# Altium project SDR_cubesat.PrjPcb (part 1 of 2)
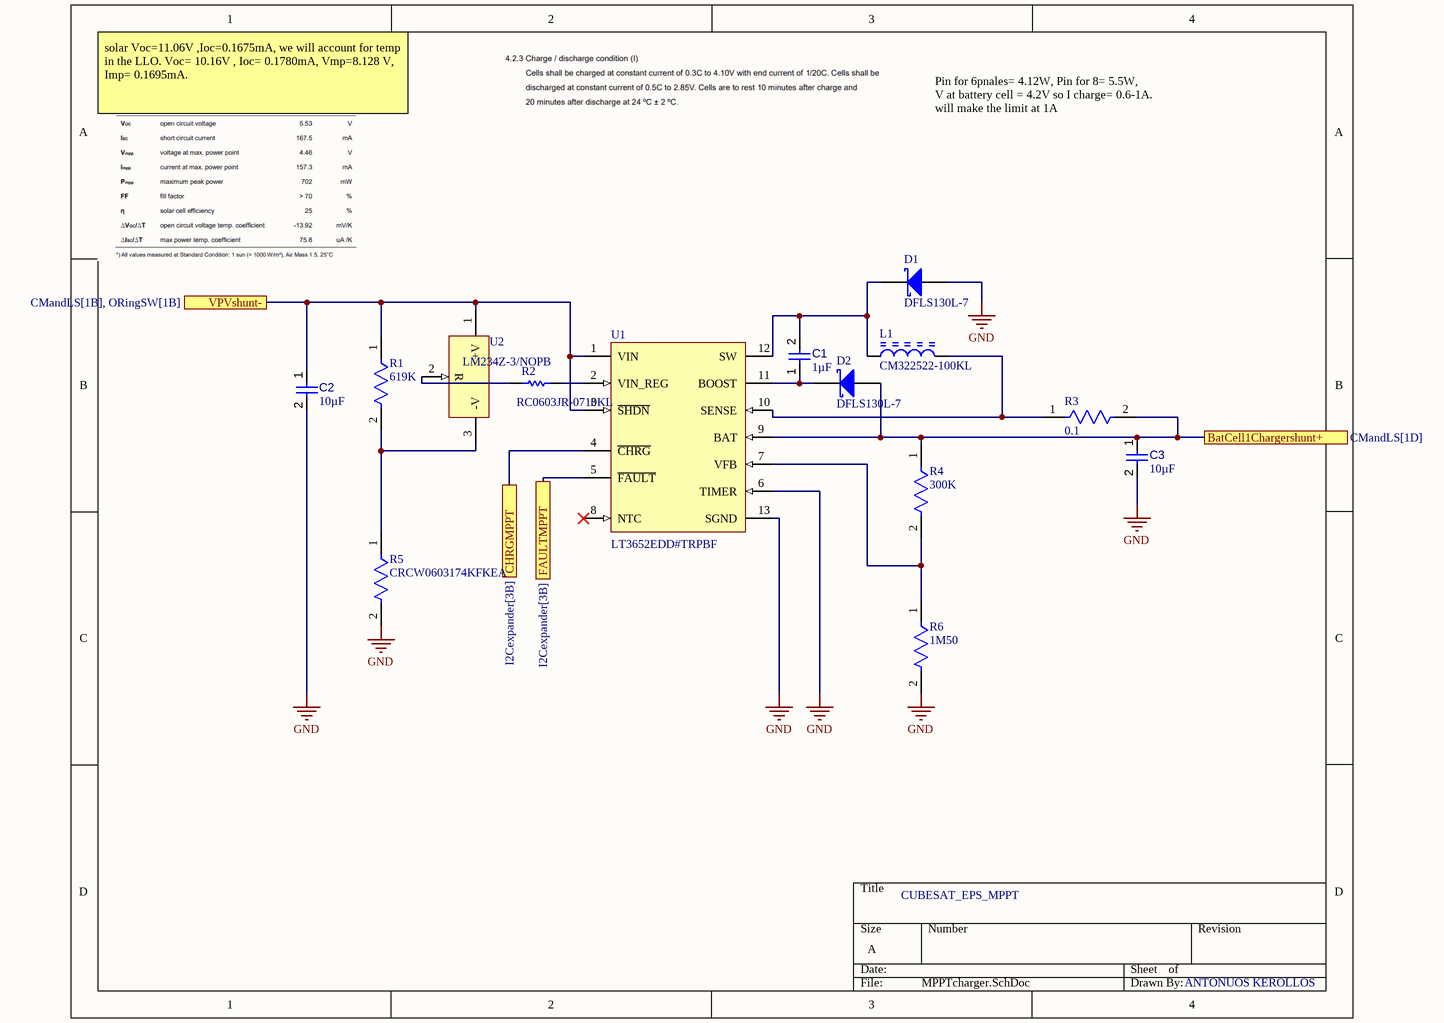
[diagram p0: MPPTcharger.SchDoc]
Drawn by: Antonuos Kerollos
10 sheets, 143 parts. Net scope: flat (ports and power ports of the same name join across sheets).
Board file: EPS.PcbDoc
Sheets:
  MPPTcharger.SchDoc
  REG3V3.SchDoc
  REG5V.SchDoc
  ORingSW.SchDoc
  I2Cexpander.SchDoc
  battery.SchDoc
  CMandLS.SchDoc
  burnwire.SchDoc
  SolarConnectors.SchDoc
  connectors.SchDoc

## Sheet MPPTcharger.SchDoc
size A; SheetNumber: 1; SheetTotal: 10

### Parts
C1  value 1µF  [CAPC0402(1005)60_L]  (hidden comment: Capacitor 1µF +/-20% 10V 0402)
C2  value 10µF  [CAPC0402(1005)60_L]  (hidden comment: Capacitor 10µF +/-40% 6.3V 0402)
C3  value 10µF  [CAPC0402(1005)60_L]  (hidden comment: Capacitor 10µF +/-40% 6.3V 0402)
D1  DFLS130L-7  [DIOD-POWERDI123-2_A_V]
D2  DFLS130L-7  [DIOD-POWERDI123-2_A_V]
L1  CM322522-100KL  [BOUR-CM322522_V]
R1  619K  [FP-CRCW0805-e3-IPC_C]
R2  RC0603JR-0710KL  [RESC1608X55X25ML10T15]
R3  0.1  [FP-ERJ8BW-IPC_A]
R4  300K  [FP-CRCW0402-e3-IPC_C]
R5  CRCW0603174KFKEA  [FP-CRCW0603-e3-IPC_B]
R6  1M50  [FP-CRCW0402-e3-IPC_C]
U1  LT3652EDD#TRPBF  [LT-DD-12_V]
U2  LM234Z-3/NOPB  [LP0003A]

### Ports
BatCell1Chargershunt+ (see CMandLS[1D]), CHRGMPPT (see I2Cexpander[3B]), FAULTMPPT (see I2Cexpander[3B]), VPVshunt- (see CMandLS[1B], ORingSW[1B])

### Nets
GND: C2.2 C3.2 D1.1(A) R5.2 R6.2 U1.6(TIMER) U1.13(SGND)
PV power: C2.1 R1.1 U1.1(VIN) U1.3(~{SHDN}) U2.1(+V) ; port VPVshunt-
NetC1_1: C1.1 D2.2(K) U1.11(BOOST)
NetC1_2: C1.2 D1.2(K) L1.1 U1.12(SW)
NetC3_1: C3.1 D2.1(A) R3.2 R4.1 U1.9(BAT) ; port BatCell1Chargershunt+
NetIC2_1: U1.4(~{CHRG}) ; port CHRGMPPT
NetIC2_2: U1.5(~{FAULT}) ; port FAULTMPPT
NetL1_2: L1.2 R3.1 U1.10(SENSE)
NetR1_2: R1.2 R5.1 U2.3(-V)
NetR2_1: R2.1 U1.2(VIN_REG)
NetR2_2: R2.2 U2.2(R)
NetR4_2: R4.2 R6.1 U1.7(VFB)

Not connected (* = marked no-connect by the designer): U1 8(NTC)*

### Notes on the sheet
- solar Voc=11.06V ,Ioc=0.1675mA, we will account for temp in the LLO. Voc= 10.16V , Ioc= 0.1780mA, Vmp=8.128 V, Imp= 0.1695mA.
- Pin for 6pnales= 4.12W, Pin for 8= 5.5W,                 V at battery cell = 4.2V so I charge= 0.6-1A.                      will make the limit at 1A
- CUBESAT_EPS_MPPT
- ANTONUOS KEROLLOS

### Library data of the parts
C1 = CMP-001-00063-3: Chip Capacitor, 1µF +/-20%, 10V, 0402, Thickness 0.6 mm; Tolerance: 10%; Mounting Technology: SMT; Max Operating Temperature: 85°C; Voltage Rating: 10V; Pins: 2; Case/Package: 0402; Min Operating Temperature: -55°C
C2 C3 = CMP-001-00074-3: Chip Capacitor, 10µF +/-40%, 6.3V, 0402, Thickness 0.6 mm; Tolerance: 10%; Case/Package: 0402; Pins: 2; Mounting Technology: SMT; Voltage Rating: 6.3V; Max Operating Temperature: 85°C; Min Operating Temperature: -55°C
D1 D2 = CMP-2000-07448-1: Schottky Barrier Rectifier, 30 V, 1 A, -40 to 125 degC, 2-Pin SMD, RoHS, Tape and Reel; Manufacturer: Diodes Inc; Max Repetitive Reverse Voltage (Vrrm): 30V; Polarity: Standard; Average Rectified Current: 1A; Element Configuration: Single; Forward Voltage: 360mV; Peak Non-Repetitive Surge Current: 50A; Max Power Dissipation: 1.67W; Case\/Package: SMD/SMT; Capacitance: 76pF; Peak Reverse Current: 1mA; Datasheet URL: https://www.diodes.com/assets/Datasheets/ds30492.pdf; Package Quantity: 3000; Reverse Voltage (DC): 30V; Package Reference: POWERDI123-2_A; Lead Free: LeadFree; Mounting Technology: SurfaceMount; Max Operating Temperature: 125degC; Current Rating: 1A; Radiation Hardening: No; Width: 1.78mm; Height: 0.98mm; Output Current: 1A; Contact Plating: Matte; Length: 2.8mm; Number of Pins: 2; Voltage Rating (DC): 30V; RoHSCompliant: true; Termination: SMD/SMT; Forward Current: 1A; Min Operating Temperature: -40degC; Datasheet Version: Rev. 4-2, 06/2009; Packaging: TapeandReel; REACH SVHC: NoSVHC; Max Forward Surge Current (Ifsm): 50A; Manufacturer URL: http://www.diodes.com/; Mount: SurfaceMount; Package Description: 2-Pin Small Outline Diode, Body 2.8 x 1.78 mm
L1 = CMP-1747-00008-1: Chip Inductor / , 10 uH, +/- 10%, -40 to 125 degC, 1210 (3225 Metric), RoHS, Tape and Reel; Current Rating: 1.5 A; Colour: White; Gender: Female; Connector Type: USB; Min Operating Temperature: -55 degC; ComponentLink2Description: Datasheet; Packaging: Tray; Contact Material: Bronze; ComponentLink1Description: Manufacturer URL; PackageDescription: 2-Pin Surface Mount Device, Body 3.2 x 2.5 mm; Contact Plating: Gold; Max Operating Temperature: 85 degC; ComponentLink2URL: http://www.bourns.com/docs/Product-Datasheets/cm322522.pdf; PackageReference: 1210; Radiation Hardening: No; DatasheetVersion: Aug-14; Package Quantity: 100; Pins: 4; Mount: Through Hole; Lead Pitch: 2.5 mm; ComponentLink1URL: http://www.bourns.com/; Height: 15.9 mm; RoHSCompliant: true; Width: 11.15 mm
R1 = CMP-2001-04045-2: RES Thick Film, 619kΩ, 1%, 0.125W, 100ppm/°C, 0805; Voltage Rating: 150V; Power Rating: 125mW; Resistance: 619kR; Width: 0.049inch; Lead Free: Lead Free; Case/Package: 0805; Termination: SMD/SMT; Height: 0.02inch; Composition: Thick Film; Depth: 1.25mm; Max Operating Temperature: 155°C; Voltage Rating (DC): 150V; Temperature Coefficient: 100ppm/°C; Military Standard: Not; Working Voltage: 150V; Radiation Hardening: No; Weight: 0.000194oz; Min Operating Temperature: -55°C; Features: Automotive AEC-Q200; Case Code (Metric): 2012; Case Code (Imperial): 0805; Number of Terminations: 2; Tolerance: 1%; Contact Plating: Tin; Max Power Dissipation: 125mW; Length: 2mm; Packaging: Tape and Reel; Number of Pins: 2; Package Quantity: 10
R2 = CMP-2000-05022-1: Resistor, 10 KOhm, +/- 5%, 100 mW, -55 to 155 degC, 0603 (1608 Metric), RoHS, Tape and Reel; Manufacturer: Yageo; Resistance: 10kOhms; Voltage Rating: 50V; Temperature Coefficient: 100PPM/C; Power Rating: 100mW; Package Reference: 603; Series: RC; Case Code - mm: 1608; Packaging: Reel; Datasheet URL: http://www.farnell.com/datasheets/443971.pdf; Datasheet Version: Rev. 4, 04/2009; Operating Temperature Range: -55Cto+155C; Product: ThickFilmResistorsGeneralPurpose; Package Description: 2-Pin Surface Mount Device, Body 1.6 x 0.8 mm; Manufacturer URL: http://www.yageo.com/; Case Code - in: 0603; Tolerance: 5%; Termination Style: SMD/SMT
R3 = CMP-2003-00785-2: RES 0.1 OHM 1% 1W 1206; Resistance: 100mR; Temperature Coefficient: 100ppm/°C; Lead Free: Lead Free; Features: Automotive AEC-Q200; Case/Package: 1206; Width: 0.063inch; Radiation Hardening: No; Power Rating: 1W; Resistance Tolerance: 1%; Resistor Type: Thick Film; Max Power Dissipation: 1W; Case Code (Metric): 3216; Package Quantity: 1; Tolerance: 1%; Number of Terminations: 2; Number of Pins: 2; Length: 3.2mm; Case Code (Imperial): 1206; Size Code: 1206; Mount: Surface Mount; Height: 0.65mm; Termination: SMD/SMT; Min Operating Temperature: -55°C; Packaging: Tape and Reel; Military Standard: Not; Series: ERJ; Depth: 1.6mm; REACH SVHC: No SVHC; Max Operating Temperature: 155°C; Contact Plating: Tin; Technology: THICK FILM; RoHS Compliant: Yes; Construction: Rectangular
R4 = CMP-2002-08495-2: RES Thick Film, 300kΩ, 1%, 0.063W, 100ppm/°C, 0402; Power Rating: 63mW; Resistance: 300kR; Voltage Rating: 50V; Case/Package: 0402; Number of Pins: 2; Depth: 0.5mm; Temperature Coefficient: 100ppm/°C; Composition: Thick Film; Length: 1mm; Termination: SMD/SMT; Tolerance: 1%; Features: Automotive AEC-Q200; Max Power Dissipation: 63mW; Packaging: Tape and Reel; Military Standard: Not; Case Code (Metric): 1005; Voltage Rating (DC): 50V; Lead Free: Lead Free; Max Operating Temperature: 155°C; Min Operating Temperature: -55°C; Width: 0.02inch; Package Quantity: 10; Height: 0.35mm; Case Code (Imperial): 0402; Number of Terminations: 2; Mount: Surface Mount; Radiation Hardening: No; Contact Plating: Tin; Weight: 2.3E-05oz
R5 = CMP-2000-02943-2: RES Thick Film, 174kΩ, 1%, 0.1W, 100ppm/°C, 0603; Power Rating: 100mW; Resistance: 174kR; Voltage Rating: 75V; Military Standard: Not; Max Operating Temperature: 155°C; Min Operating Temperature: -55°C; Radiation Hardening: No; Depth: 0.85mm; Composition: Thick Film; Width: 0.033inch; Max Power Dissipation: 100mW; Case Code (Imperial): 0603; Number of Pins: 2; Contact Plating: Tin; Number of Terminations: 2; Temperature Coefficient: 100ppm/°C; Features: Automotive AEC-Q200; Packaging: Tape and Reel; Length: 1.55mm; Weight: 7.1E-05oz; Termination: SMD/SMT; Case Code (Metric): 1608; Tolerance: 1%; Height: 0.02inch; Case/Package: 0603; Package Quantity: 10
R6 = CMP-2002-08330-2: RES Thick Film, 1.5MΩ, 1%, 0.063W, 100ppm/°C, 0402; Max Power Dissipation: 63mW; Voltage Rating: 50V; Resistance: 1.5MR; Military Standard: Not; Height: 0.35mm; Temperature Coefficient: 100ppm/°C; Max Operating Temperature: 155°C; Case Code (Metric): 1005; Case Code (Imperial): 0402; Number of Pins: 2; Radiation Hardening: No; Composition: Thick Film; Contact Plating: Tin; Case/Package: 0402; Features: Automotive AEC-Q200; Package Quantity: 10; Depth: 0.5mm; Weight: 2.3E-05oz; Mount: Surface Mount; Number of Terminations: 2; Min Operating Temperature: -55°C; Lead Free: Lead Free; Length: 1mm; Tolerance: 1%; Power Rating: 63mW; Voltage Rating (DC): 50V; Packaging: Tape and Reel; Termination: SMD/SMT; Width: 0.02inch
U1 = CMP-0473-00065-1: Power Tracking 2 A Battery Charger for Solar Power, 12-pin SON (DD-12), -40 to 125 degC, Pb-Free, Tape and Reel; Manufacturer: Linear Technology; Number of Outputs: 1; Vin Max(V): 32; Vin Min(V): 4.95; ComponentLink2URL: http://cds.linear.com/docs/en/datasheet/3652fd.pdf; ComponentLink3Description: Package Specification; Topology: Battery Charger; ComponentLink1URL: http://www.linear.com/; Energy Source: Solar; RoHS: TRUE; ComponentLink2Description: Datasheet; Packing: Tape and Reel; DatasheetVersion: Rev. D; PackageVersion: Rev. A, 06/2010; PartNumber: LT3652EDD#TRPBF; PackageReference: DD-12; Mounting Technology: Surface Mount; PackageDescription: 12-Pin Plastic DFN, Body 3 x 3 mm, Pitch 0.45 mm; ComponentLink3URL: http://cds.linear.com/docs/en/packaging/DFN_12_05-08-1725.pdf; ComponentLink1Description: Manufacturer URL
U2 = CMP-0063-00072-3: 3-Terminal Adjustable Current Source, 3-pin TO-92, Pb-Free; Manufacturer: Texas Instruments; PowerWise: N; CompType: MiscPower; PackageTopMarking: NSXYTT*LM234*Z-3; RoHS: Y; PinCount: 3; PackageDescription: TO-92, Molded, 3 Lead; Code_JEDEC: TO-226-AA; PackageReference: LP0003A; ComponentLink1URL: http://www.ti.com/general/docs/lit/getliterature.tsp?genericPartNumber=LM234&fileType=pdf; ComponentLink1Description: Datasheet URL

## Sheet REG3V3.SchDoc
size A; SheetNumber: 2; SheetTotal: 10
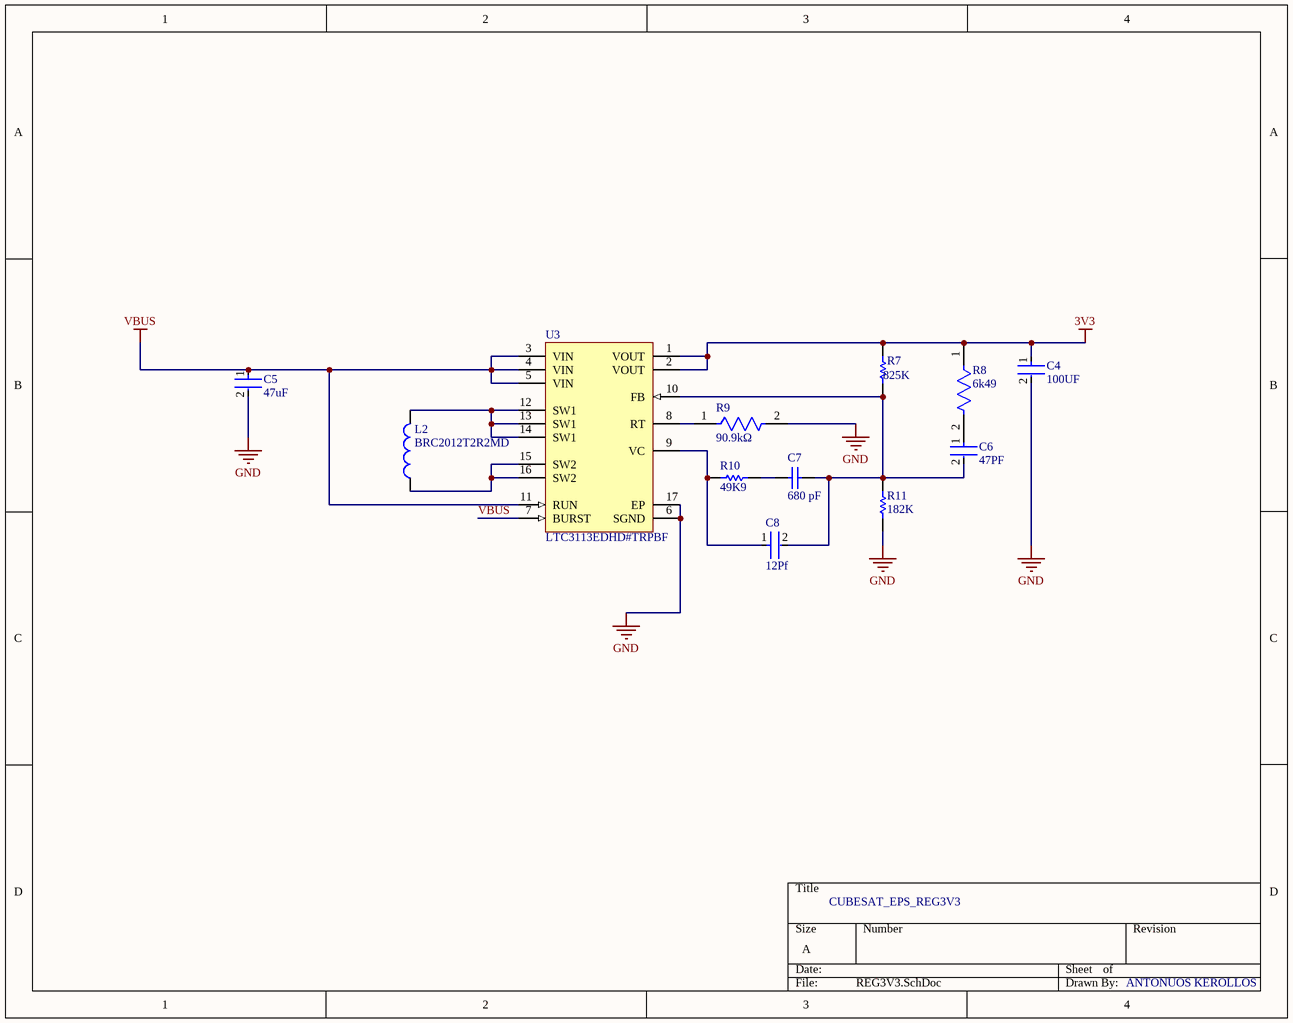
[diagram p1: REG3V3.SchDoc]

### Parts
C4  100UF  [FP-C1210C-FS-MFG]
C5  47uF  [FP-C3216-160-0_2-MFG]
C6  47PF  [FP-C0805C-DN-MFG]
C7  680 pF  [CAPC1005X55X25ML05T10]
C8  12Pf  [FP-C0603C-CF-MFG]
L2  BRC2012T2R2MD  [INDC2013X140X50LL20T20]
R7  825K  [RESC1005X40X25NL05T05]
R8  6k49  [FP-ERJ2RK-MFG]
R9  90.9kΩ  [FP-CRCW0402-e3-IPC_B]
R10  49K9  [RESC1005X40X25LL05T05]
R11  182K  [RESC1005X40X25ML05T05]
U3  LTC3113EDHD#TRPBF  [LT-DHD-16_V]

### Nets
3V3: C4.1 R7.2 R8.1 U3.1(VOUT) U3.2(VOUT)
GND: C4.2 C5.2 R9.2 R11.2 U3.6(SGND) U3.17(EP)
VBUS: C5.1 U3.3(VIN) U3.4(VIN) U3.5(VIN) U3.7(BURST) U3.11(RUN)
NetC6_1: C6.1 R8.2
NetC6_2: C6.2 C7.2 C8.2 R7.1 R11.1 U3.10(FB)
NetC7_1: C7.1 R10.2
NetC8_1: C8.1 R10.1 U3.9(VC)
NetL2_1: L2.1 U3.15(SW2) U3.16(SW2)
NetL2_2: L2.2 U3.12(SW1) U3.13(SW1) U3.14(SW1)
NetR9_1: R9.1 U3.8(RT)

### Notes on the sheet
- CUBESAT_EPS_REG3V3
- ANTONUOS KEROLLOS

### Library data of the parts
C4 = CMP-03020-034653-1: CAP CER 100UF 16V X5R 1210; Tolerance: 20%; Dielectric Material: Ceramic; Max Operating Temperature: 85°C; REACH SVHC: No SVHC; Case Code (Metric): 3225; Case/Package: 1210; Thickness: 0.106inch; Length: 3.2mm; Min Operating Temperature: -55°C; Voltage Rating (DC): 16V; Weight: 0.000564oz; Packaging: Tape and Reel; Case Code (Imperial): 1210; Depth: 2.5mm; Lead Free: Lead Free; Width: 0.098inch; Voltage Rating: 16V; Capacitance: 100uF; Termination: SMD/SMT; Dielectric: X5R; Package Quantity: 1000
C5 = CMP-2000-05397-3: Multilayer Ceramic Capacitors 47uF ±20% 25V X5R SMD 1206; Weight: 0.000571oz; Dielectric: X5R; Length: 0.126inch; Voltage Rating: 25V; Case/Package: 1206; Dielectric Material: Ceramic; Min Operating Temperature: -55°C; Lead Free: Lead Free; Packaging: Tape and Reel; Package Quantity: 1; Mount: Surface Mount; Depth: 1.6mm; REACH SVHC: No SVHC; Termination: SMD/SMT; Case Code (Imperial): 1206; Series: C; Resistor Type: Ceramic; Voltage: 25V; Width: 0.063inch; Height: 1.6mm; Tolerance: 20%; Capacitance: 47uF; Max Operating Temperature: 85°C; Voltage Rating (DC): 25V; RoHS Compliant: Yes; Thickness: 0.071inch; Case Code (Metric): 3216
C6 = CMP-2007-00435-2: CAP CER 47PF 50V C0G/NP0 0805; Manufacturer: KEMET; Manufacturer Part Number: C0805C470J5GACTU; Temperature Characteristic: C0G; Material: Ceramic; Temperature Coefficient: 30ppm/°C; Tolerance: 0.05; Temperature Range High: +125°C; Device Class L1: Passive Components; Device Class L3: Ceramic Capacitors; Lead Free: Yes; Temperature: -55°C to +125°C; Capacitance: 47 pF; Height: 0.88mm; Octopart: https://octopart.com/c0805c470j5gactu-kemet-150274; RoHS: TRUE; Category: Cap; Voltage Rating: 50 V; Automotive: No; Device Class L2: Capacitors; Value: 47 pF; Ipc Land Pattern Name: CAPC200125X78; Temperature Range Low: -55°C; Mouser Description: Multilayer Ceramic Capacitors MLCC - SMD/SMT 50volts 47pF C0G 5%; Package: C0805C-DN; Digikey Description: CAP CER 47PF 50V C0G/NP0 0805; ComponentLink2URL: https://content.kemet.com/datasheets/KEM_C1003_C0G_SMD.pdf; ComponentLink2Description: Datasheet
C7 = CMP-2008-04665-4: Chip Capacitor, 680 pF, +/- 10%, 50 V, -55 to 125 degC, 0402 (1005 Metric), RoHS, Tape and Reel; Manufacturer: Basic Passives; PartNumber: GRM155R71H681KA01D; Voltage Rating: 50 V; Type (Capacitors): X7R; Case\/Package: 0402; ComponentLink1Description: Manufacturer URL; Capacitance: 680 pF; Mount: Surface Mount; Length: 1 mm; Max Operating Temperature: 125 degC; PackageDescription: 2-Pin Surface Mount Device, Body 1 x 0.5 mm; Width: 0.5 mm; Tolerance: 10%; ComponentLink2URL: http://search.murata.co.jp/Ceramy/image/img/A01X/G101/ENG/GRM155R71H681KA01-01.pdf; RoHSCompliant: true; Package Quantity: 10000; ComponentLink2Description: Datasheet; Case Code (Metric): 1005; Min Operating Temperature: -55 degC; PackageReference: 0402; Case Code (Imperial): 0402; Height: 0.5 mm; Radiation Hardening: No; Mounting Technology: Surface Mount; Pins: 2; Packaging: Tape and Reel; Lead Pitch: 2 mm; Voltage Rating (DC): 50 V; ComponentLink1URL: http://www.murata.com/; DatasheetVersion: 02/2016
C8 = CMP-2006-03703-3: Ceramic Capacitor 12Pf 50V, C0G, 5%, 0603, Full Reel; Manufacturer: KEMET; Manufacturer Part Number: C0603C120J5GACTU; Automotive Grade: Grade 1; Temperature Coefficient: 30ppm/°C; Tolerance: 0.05; Temperature Range High: +125°C; Temperature Characteristic: C0G; Temperature Range Low: -55°C; Voltage Rating: 50 V; Mouser Description: Ceramic Capacitor 12Pf 50V, C0G, 5%, 0603, Full Reel; Package: C0603C-CF; Temperature: -55°C to +125°C; Device Class L3: Ceramic Capacitors; Value: 12 pF; Material: Ceramic; Lead Free: Yes; ComponentLink2URL: https://api.kemet.com/component-edge/download/datasheet/C0603C100J5GACAUTO.pdf; Category: Cap; Capacitance: 12 pF; ComponentLink2Description: Datasheet; Device Class L1: Passive Components; Height: 0.87mm; Device Class L2: Capacitors; Digikey Description: Ceramic Capacitor 12Pf 50V, C0G, 5%, 0603, Full Reel; RoHS: TRUE; Octopart: https://octopart.com/c0603c120j5gactu-kemet-108780; Automotive: Yes
L2 = CMP-2000-05964-1: Wire-Wound Chip Power Inductor, 2.2 uH, +/- 20%, -40 to 105 degC, 2-Pin SMD (0805), RoHS, Tape and Reel; Manufacturer: Taiyo Yuden; Inductance: 2.2µH; Other Names: 587-2905-2 / LQBRC2012T2R2MD; Type: Wirewound; Current - Saturation: 1.1A; Online Catalog: BRSeries; EDA / CAD Models: DownloadfromAcceleratedDesigns; Shielding: Unshielded; DC Resistance (DCR): 143mOhmMax; Current Rating: 1A; Frequency - Test: 1MHz; Frequency - Self Resonant: 350MHz; Series: BR; Size / Dimension: 0.079"Lx0.049"W(2.00mmx1.25mm); Datasheet URL: http://ds.yuden.co.jp/TYCOMPAS/ut/detail.do?productNo=BRC2012T2R2MD&fileName=BRC2012T2R2MD_SS&mode=specSheetDownload; Tolerance: ±20%; Mounting Technology: SurfaceMount; Standard Package: 2,000; Category: Inductors,Coils,Chokes; Operating Temperature: -40°C~105°C; Mounting Type: SurfaceMount; Height - Seated (Max): 0.055"(1.40mm); Datasheet Version: 09/2016; Package Reference: 0805; Package Description: 2-Pin Surface Mount Device, Body 2 x 1.25 mm; Packaging: Tape&Reel(TR); Package / Case: 0805(2012Metric); Family: FixedInductors; Manufacturer URL: http://www.t-yuden.com/
R7 = CMP-2002-00233-1: Manufacturer: Vishay Dale; Part Number: CRCW0402825KFKED
R8 = CMP-2002-01028-2: NexarPartId: 55421257; Max Power Dissipation: 100mW; Resistance: 6.49kΩ; Voltage Rating: 50V; Tolerance: 1%; Temperature Coefficient: 100ppm/°C; RoHS: Compliant; Number of Terminations: 2; Case Code (Metric): 1005; Schedule B: 8533210045, 8533210045; Composition: Thick Film; Lead Free: Lead Free; Length: 1mm; Voltage Rating (DC): 50V; Max Operating Temperature: 155°C; Width: 508µm; Case Code (Imperial): 0402; REACH SVHC: No SVHC; Depth: 500µm; Contact Plating: Tin; Power Rating: 100mW; Military Standard: Not; Termination: SMD/SMT; Case/Package: 0402; Min Operating Temperature: -55°C; Packaging: Cut Tape; Height: 406.4µm; Lifecycle Status: Production; Mount: Surface Mount
R9 = CMP-2002-00265-2: RES Thick Film, 90.9kΩ, 1%, 0.063W, 100ppm/°C, 0402; Voltage Rating (DC): 50V; Resistance: 90.9kR; Power Rating: 63mW; Case Code (Imperial): 0402; Packaging: Tape and Reel; Number of Pins: 2; Height: 0.35mm; Military Standard: Not; Min Operating Temperature: -55°C; Depth: 0.5mm; Contact Plating: Tin; Radiation Hardening: No; Termination: SMD/SMT; Lead Free: Lead Free; Case/Package: 0402; Temperature Coefficient: 100ppm/°C; Composition: Thick Film; Case Code (Metric): 1005; Weight: 2.3E-05oz; Number of Terminations: 2; Max Operating Temperature: 155°C; Length: 1mm; Max Power Dissipation: 63mW; Voltage Rating: 50V; Tolerance: 1%; Mount: Surface Mount; Features: Automotive AEC-Q200; Package Quantity: 10; Width: 0.02inch
R10 = CMP-2002-00039-1: Part Number: CRCW040249K9FKED; Manufacturer: Vishay Dale
R11 = CMP-2002-08256-1: Manufacturer: Vishay Dale; Part Number: CRCW0402182KFKED
U3 = CMP-0492-00444-1: 3 A Low Noise Buck-Boost DC/DC Converter, 16-pin SON (DHD-16), -40 to 125 degC, Pb-Free, Tape and Reel; Manufacturer: Linear Technology; Frequency Sync Range: 300kHz - 2MHz; Number of Outputs: 1; Mounting Technology: Surface Mount; ComponentLink3URL: http://cds.linear.com/docs/en/packaging/DFN_16_05-08-1707.pdf; PackageReference: DHD-16; PackageVersion: Jun-10; ComponentLink3Description: Package Specification; RoHS: TRUE; ComponentLink2Description: Datasheet; Code_JEDEC: MO-229; ComponentLink2URL: http://cds.linear.com/docs/en/datasheet/3113f.pdf; PartNumber: LTC3113EDHD#TRPBF; Packing: Tape and Reel; ComponentLink1Description: Manufacturer URL; PackageDescription: 16-Pin Plastic DFN, Body 5 x 4 mm, Pitch 0.5 mm; ComponentLink1URL: http://www.linear.com/

## Sheet REG5V.SchDoc
size A; SheetNumber: 3; SheetTotal: 10
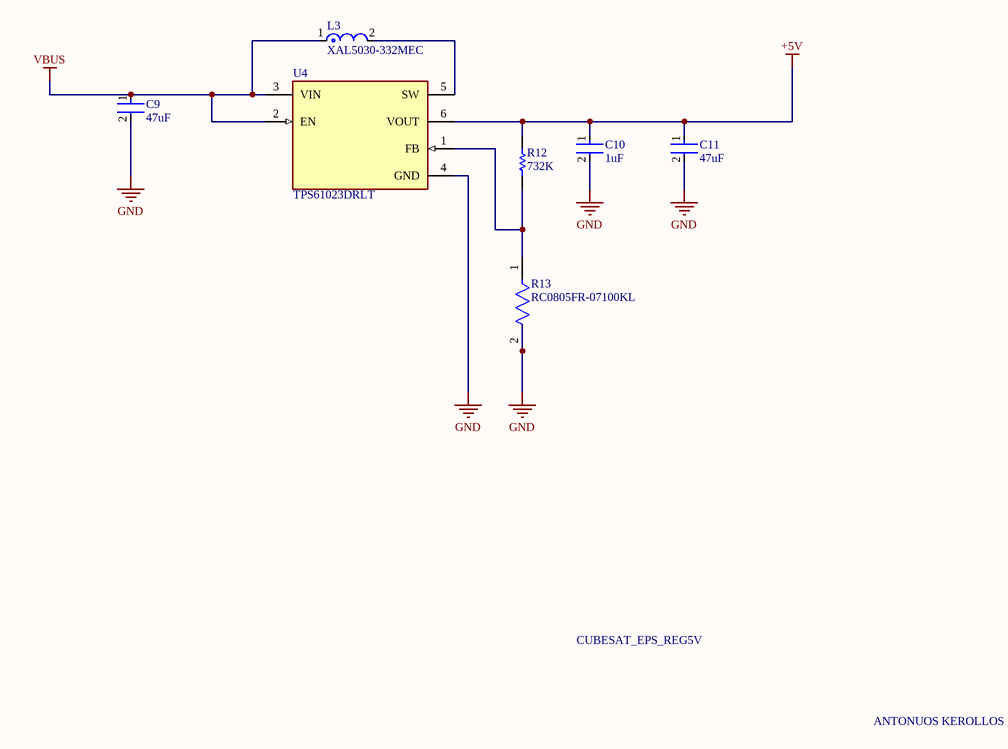
[diagram p2: REG5V.SchDoc]

### Parts
C9  47uF  [FP-GRM32E-0_3-0_2-IPC_A]
C10  1uF  [FP-CL10-IPC_B]
C11  47uF  [FP-GRM32E-0_3-0_2-IPC_A]
L3  XAL5030-332MEC  [FP-XAL5030-MFG]
R12  732K  [RESC2013X60X35ML10T20]
R13  RC0805FR-07100KL  [FP-RC0805-0_6-IPC_C]
U4  TPS61023DRLT  [FP-DRL0006A-MFG]

### Nets
+5V: C10.1 C11.1 R12.1 U4.6(VOUT)
GND: C9.2 C10.2 C11.2 R13.2 U4.4(GND)
VBUS: C9.1 L3.1 U4.2(EN) U4.3(VIN)
NetL3_2: L3.2 U4.5(SW)
NetR12_2: R12.2 R13.1 U4.1(FB)

### Notes on the sheet
- CUBESAT_EPS_REG5V
- ANTONUOS KEROLLOS

### Library data of the parts
C9 C11 = CMP-06035-000110-2: Chip Multilayer Ceramic Capacitors for General Purpose, 1210, 47uF, X6S, 22%, 10%, 16V; Case Code (Metric): 3225; Packaging: Tape and Reel; Mount: Surface Mount; Material: Ceramic; Voltage: 16V; Dielectric: X6S; Depth: 2.5mm; Min Operating Temperature: -55°C; Width: 2.5mm; Height: 2.5mm; Voltage Rating: 16V; Weight: 0.00388oz; Case Code (Imperial): 1210; Max Operating Temperature: 105°C; Capacitance: 47uF; Package Quantity: 1000; Case/Package: 1210; Voltage Rating (DC): 16V; Termination: SMD/SMT; Length: 3.2mm; Thickness: 0.106inch; Tolerance: 10%; Lead Free: Lead Free; REACH SVHC: No SVHC
C10 = CMP-13271-002470-1: Cap Ceramic 1uF 10V X7R ±10% Pad SMD 0603 +125°C T/R; Dielectric: X7R; Width: 0.031inch; Packaging: Tape and Reel; Voltage Rating: 10V; Length: 0.063inch; Capacitance: 1uF; Radiation Hardening: No; Case Code (Metric): 1608; Mount: Surface Mount; Min Operating Temperature: -55°C; Case/Package: 0603; Thickness: 0.035inch; Package Quantity: 1; Tolerance: 10%; Case Code (Imperial): 0603; Max Operating Temperature: 125°C; Height: 0.8mm; Depth: 0.8mm
L3 = CMP-11268-000123-1: Fixed Inductors 3.3uH Shld 20% 8.1A 23.3mOhms AECQ2; Core Material: Composite; Self Resonant Frequency: 28MHz; DC Resistance (DCR): 23.3mR; Test Frequency: 100kHz; Saturation Current: 8.7A; Shielding: Shielded; Max Operating Temperature: 125°C; Lead Free: Contains Lead; Inductance: 3.3uH; Case/Package: SMD/SMT; Package Quantity: 400; Height: 3.1mm; RoHS Compliant: Yes; RMS Current (Irms): 8.1A; Series: XAL5030; Tolerance: 20%; Inductance Tolerance: 20%; REACH SVHC: No SVHC; Termination: SMD/SMT; Mount: Surface Mount; Width: 5.48mm; Max DC Current: 8.1A; Min Operating Temperature: -40°C; Packaging: Tape and Reel; Length: 5.68mm
R12 = CMP-2001-01259-1: Manufacturer: Yageo; Part Number: RC0805FR-07732KL
R13 = CMP-2100-03668-5: RES 100K OHM 1% 1/8W 0805; Power Rating: 125mW; Temperature Coefficient: 100ppm/°C; Voltage Rating (DC): 150V; Resistance: 100kR; Package Quantity: 1; Case/Package: 0805; Lead Pitch: 0.4mm; Case Code (Imperial): 0805; Construction: Rectangular; Number of Terminations: 2; RoHS Compliant: Yes; Max Power Dissipation: 125mW; Tolerance: 1%; Max Operating Temperature: 155°C; Resistance Tolerance: 1%; Lead Free: Lead Free; Packaging: Tape and Reel; Resistor Type: Thick Film; Min Operating Temperature: -55°C; Case Code (Metric): 2012; Series: RC; Technology: THICK FILM; Voltage Rating: 150V; Termination: SMD/SMT; Width: 0.049inch; Number of Pins: 2; Features: Moisture Resistant; Military Standard: Not; Length: 0.079inch; Depth: 1.25mm; Size Code: 0805; Height: 0.024inch
U4 = CMP-04918-000657-1: IC REG BOOST ADJ 3A SOT563

## Sheet ORingSW.SchDoc
size A; SheetNumber: 4; SheetTotal: 10
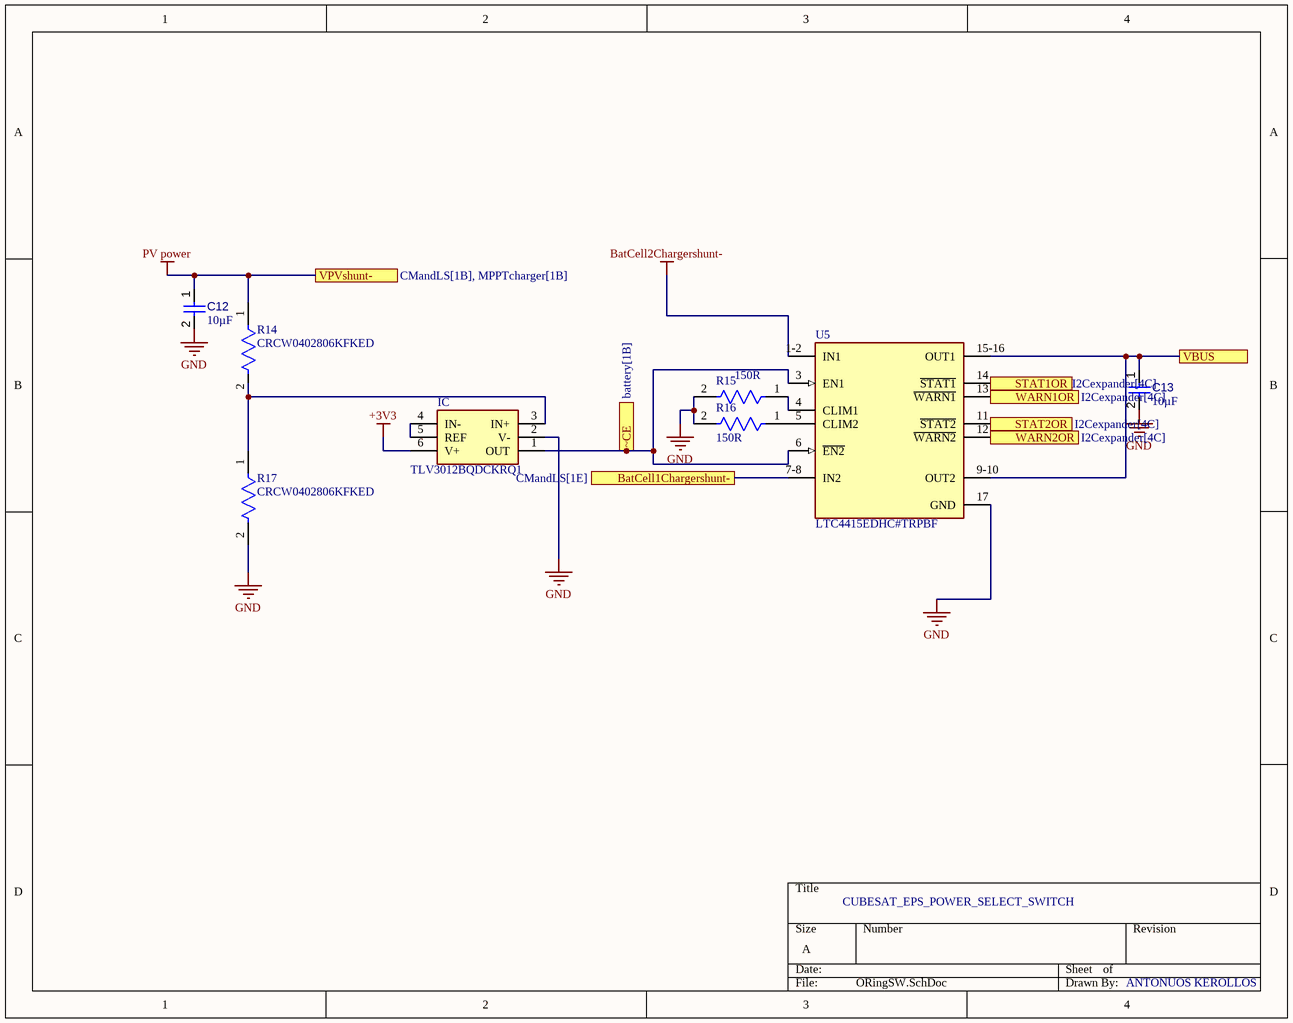
[diagram p3: ORingSW.SchDoc]

### Parts
C12  value 10µF  [CAPC0402(1005)60_L]  (hidden comment: Capacitor 10µF +/-40% 6.3V 0402)
C13  value 10µF  [CAPC0402(1005)60_L]  (hidden comment: Capacitor 10µF +/-40% 6.3V 0402)
IC  TLV3012BQDCKRQ1  [SOT65P210X110-6N]
R14  CRCW0402806KFKED  [FP-CRCW0402-e3-IPC_A]
R15  150R  [FP-CRCW0402-e3-IPC_A]
R16  150R  [FP-CRCW0402-e3-IPC_A]
R17  CRCW0402806KFKED  [FP-CRCW0402-e3-IPC_A]
U5  LTC4415EDHC#TRPBF  [FP-DHC-16-05-08-1872-A-MFG]

### Ports
BatCell1Chargershunt- (see CMandLS[1E]), STAT1OR (see I2Cexpander[4C]), STAT2OR (see I2Cexpander[4C]), VBUS, VPVshunt- (see CMandLS[1B], MPPTcharger[1B]), WARN1OR (see I2Cexpander[4C]), WARN2OR (see I2Cexpander[4C]), ~CE (see battery[1B])

### Nets
+3V3: IC.6(V+)
BatCell2Chargershunt-: U5.1-2(IN1)
GND: C12.2 C13.2 IC.2(V-) R15.2 R16.2 R17.2 U5.17(GND)
PV power: C12.1 R14.1 ; port VPVshunt-
NetC13_1: C13.1 U5.9-10(OUT2) U5.15-16(OUT1) ; port VBUS
NetIC2_13: U5.14(~{STAT1}) ; port STAT1OR
NetIC2_14: U5.13(~{WARN1}) ; port WARN1OR
NetIC2_15: U5.11(~{STAT2}) ; port STAT2OR
NetIC2_16: U5.12(~{WARN2}) ; port WARN2OR
NetIC_1: IC.1(OUT) U5.3(EN1) U5.6(~{EN2}) ; port ~CE
NetIC_3: IC.3(IN+) R14.2 R17.1
NetIC_4: IC.4(IN-) IC.5(REF)
NetR15_1: R15.1 U5.4(CLIM1)
NetR16_1: R16.1 U5.5(CLIM2)
NetR48_2: U5.7-8(IN2) ; port BatCell1Chargershunt-

### Notes on the sheet
- CUBESAT_EPS_POWER_SELECT_SWITCH
- ANTONUOS KEROLLOS

### Library data of the parts
C12 C13 = CMP-001-00074-3: as C2 on sheet MPPTcharger; Case/Package: 0402; Pins: 2; Mounting Technology: SMT; Voltage Rating: 6.3V; Max Operating Temperature: 85°C; Min Operating Temperature: -55°C
IC = TLV3012BQDCKRQ1: Integrated Circuit; Manufacturer_Name: Texas Instruments; Datasheet Link: https://www.ti.com/lit/ds/symlink/tlv3012b-q1.pdf?ts=1694855984028&ref_url=https%253A%252F%252Fwww.ti.com%252Fproduct%252FTLV3012B-Q1%252Fpart-details%252FTLV3012BQDCKRQ1; Height: 1.1mm; Manufacturer_Part_Number: TLV3012BQDCKRQ1; Mouser Part Number: 595-TLV3012BQDCKRQ1; Mouser Price/Stock: https://www.mouser.co.uk/ProductDetail/Texas-Instruments/TLV3012BQDCKRQ1?qs=3Rah4i%252BhyCFJC4yY2NAdNA%3D%3D
R14 R17 = CMP-2002-00226-2: RES Thick Film, 806kΩ, 1%, 0.063W, 100ppm/°C, 0402; Power Rating: 63mW; Voltage Rating (DC): 50V; Resistance: 806kR; Case Code (Imperial): 0402; Radiation Hardening: No; Contact Plating: Tin; Weight: 2.3E-05oz; Height: 0.35mm; Depth: 0.5mm; Temperature Coefficient: 100ppm/°C; Composition: Thick Film; Lead Free: Lead Free; Number of Terminations: 2; Case Code (Metric): 1005; Features: Automotive AEC-Q200; Mount: Surface Mount; Voltage Rating: 50V; Max Operating Temperature: 155°C; Length: 1mm; Packaging: Tape and Reel; Min Operating Temperature: -55°C; Case/Package: 0402; Max Power Dissipation: 63mW; Military Standard: Not; Package Quantity: 10; Tolerance: 1%; Termination: SMD/SMT; Width: 0.5mm
R15 R16 = CMP-2002-08214-2: RES Thick Film, 150Ω, 1%, 0.063W, 100ppm/°C, 0402; Power Rating: 63mW; Voltage Rating: 50V; Packaging: Tape and Reel; Height: 0.35mm; Radiation Hardening: No; Min Operating Temperature: -55°C; Mount: Surface Mount; Contact Plating: Tin; Case/Package: 0402; Width: 0.5mm; Case Code (Imperial): 0402; Length: 1mm; Tolerance: 1%; Lead Free: Lead Free; Case Code (Metric): 1005; Military Standard: Not; Max Operating Temperature: 155°C; Temperature Coefficient: 100ppm/°C; Resistance: 150R; Weight: 2.3E-05oz; Voltage Rating (DC): 50V; Depth: 0.5mm; Package Quantity: 10000; Composition: Thick Film; Termination: SMD/SMT
U5 = CMP-0479-00073-2: IC OR CTRLR SRC SELECT 16DFN; Operating Supply Current: 44uA; Max Output Current: 4A; Package Quantity: 2500; Series: PowerPath™; Length: 5mm; Case/Package: DFN; Number of Pins: 16; Max Operating Temperature: 125°C; Packaging: Tape and Reel; RoHS Compliant: Yes; Min Operating Temperature: -40°C

## Sheet I2Cexpander.SchDoc
size A; SheetNumber: 5; SheetTotal: 10
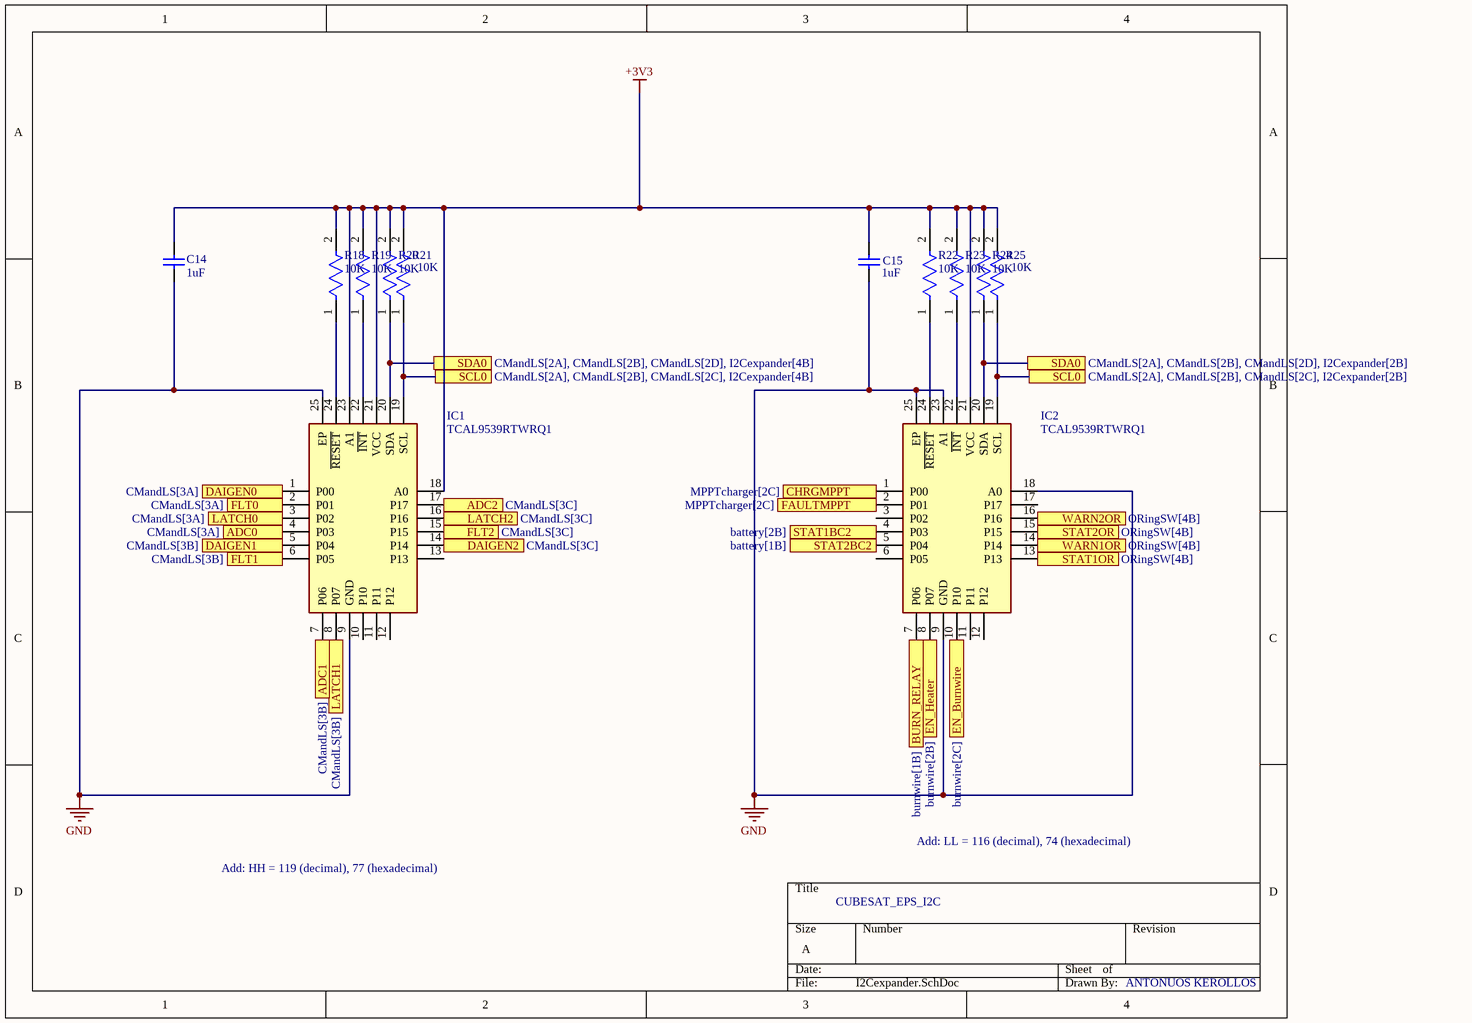
[diagram p4: I2Cexpander.SchDoc]

### Parts
C14  1uF  [CAPC2013X140X50LL20T25]
C15  1uF  [CAPC2013X140X50LL20T25]
IC1  TCAL9539RTWRQ1  [QFN50P400X400X80-25N-D]
IC2  TCAL9539RTWRQ1  [QFN50P400X400X80-25N-D]
R18  10K  [FP-CRCW0805-e3-IPC_A]
R19  10K  [FP-CRCW0805-e3-IPC_A]
R20  10K  [FP-CRCW0805-e3-IPC_A]
R21  10K  [FP-CRCW0805-e3-IPC_A]
R22  10K  [FP-CRCW0805-e3-IPC_A]
R23  10K  [FP-CRCW0805-e3-IPC_A]
R24  10K  [FP-CRCW0805-e3-IPC_A]
R25  10K  [FP-CRCW0805-e3-IPC_A]

### Ports
ADC0 (see CMandLS[3A]), ADC1 (see CMandLS[3B]), ADC2 (see CMandLS[3C]), BURN_RELAY (see burnwire[1B]), CHRGMPPT (see MPPTcharger[2C]), DAIGEN0 (see CMandLS[3A]), DAIGEN1 (see CMandLS[3B]), DAIGEN2 (see CMandLS[3C]), EN_Burnwire (see burnwire[2C]), EN_Heater (see burnwire[2B]), FAULTMPPT (see MPPTcharger[2C]), FLT0 (see CMandLS[3A]), FLT1 (see CMandLS[3B]), FLT2 (see CMandLS[3C]), LATCH0 (see CMandLS[3A]), LATCH1 (see CMandLS[3B]), LATCH2 (see CMandLS[3C]), SCL0 (see CMandLS[2A], CMandLS[2B], CMandLS[2C], I2Cexpander[2B]), SCL0 (see CMandLS[2A], CMandLS[2B], CMandLS[2C], I2Cexpander[4B]), SDA0 (see CMandLS[2A], CMandLS[2B], CMandLS[2D], I2Cexpander[2B]), SDA0 (see CMandLS[2A], CMandLS[2B], CMandLS[2D], I2Cexpander[4B]), STAT1BC2 (see battery[2B]), STAT1OR (see ORingSW[4B]), STAT2BC2 (see battery[1B]), STAT2OR (see ORingSW[4B]), WARN1OR (see ORingSW[4B]), WARN2OR (see ORingSW[4B])

### Nets
+3V3: C14.2 C15.2 IC1.18(A0) IC1.21(VCC) IC1.23(A1) IC2.21(VCC) R18.2 R19.2 R20.2 R21.2 R22.2 R23.2 R24.2 R25.2
GND: C14.1 C15.1 IC1.9(GND) IC1.25(EP) IC2.9(GND) IC2.18(A0) IC2.23(A1) IC2.25(EP)
NetIC1_1: IC1.1(P00) ; port DAIGEN0
NetIC1_2: IC1.2(P01) ; port FLT0
NetIC1_3: IC1.3(P02) ; port LATCH0
NetIC1_4: IC1.4(P03) ; port ADC0
NetIC1_5: IC1.5(P04) ; port DAIGEN1
NetIC1_6: IC1.6(P05) ; port FLT1
NetIC1_7: IC1.7(P06) ; port ADC1
NetIC1_8: IC1.8(P07) ; port LATCH1
NetIC1_14: IC1.14(P14) ; port DAIGEN2
NetIC1_15: IC1.15(P15) ; port FLT2
NetIC1_16: IC1.16(P16) ; port LATCH2
NetIC1_17: IC1.17(P17) ; port ADC2
NetIC1_19: IC1.19(SCL) IC2.19(SCL) R21.1 R25.1 ; port SCL0
NetIC1_20: IC1.20(SDA) IC2.20(SDA) R20.1 R24.1 ; port SDA0
NetIC1_22: IC1.22(~{INT}) R19.1
NetIC1_24: IC1.24(~{RESET}) R18.1
NetIC2_1: IC2.1(P00) ; port CHRGMPPT
NetIC2_2: IC2.2(P01) ; port FAULTMPPT
NetIC2_4: IC2.4(P03) ; port STAT1BC2
NetIC2_5: IC2.5(P04) ; port STAT2BC2
NetIC2_7: IC2.7(P06) ; port BURN_RELAY
NetIC2_8: IC2.8(P07) ; port EN_Heater
NetIC2_10: IC2.10(P10) ; port EN_Burnwire
NetIC2_13: IC2.13(P13) ; port STAT1OR
NetIC2_14: IC2.14(P14) ; port WARN1OR
NetIC2_15: IC2.15(P15) ; port STAT2OR
NetIC2_16: IC2.16(P16) ; port WARN2OR
NetIC2_22: IC2.22(~{INT}) R23.1
NetIC2_24: IC2.24(~{RESET}) R22.1

Not connected (* = marked no-connect by the designer): IC1 10(P10) 11(P11) 12(P12) 13(P13); IC2 3(P02) 6(P05) 11(P11) 12(P12) 17(P17)

### Notes on the sheet
- Add: HH = 119 (decimal), 77 (hexadecimal)
- CUBESAT_EPS_I2C
- Add: LL = 116 (decimal), 74 (hexadecimal)
- ANTONUOS KEROLLOS

### Library data of the parts
C14 C15 = CMP-2007-03234-1: Part Number: C0805C105K3RACTU; Manufacturer: Kemet
IC1 IC2 = TCAL9539RTWRQ1: Integrated Circuit; Manufacturer_Name: Texas Instruments; Datasheet Link: https://www.ti.com/lit/ds/symlink/tcal9539-q1.pdf?HQS=dis-mous-null-mousermode-dsf-pf-null-wwe&ts=1700652795434&ref_url=https%253A%252F%252Fwww.mouser.co.il%252F; Height: 0.8mm; Manufacturer_Part_Number: TCAL9539RTWRQ1; Mouser Part Number: 595-TCAL9539RTWRQ1; Mouser Price/Stock: https://www.mouser.co.uk/ProductDetail/Texas-Instruments/TCAL9539RTWRQ1?qs=HoCaDK9Nz5cqBCs4xXWfwA%3D%3D; Arrow Part Number: TCAL9539RTWRQ1; Arrow Price/Stock: null?region=nac
R18-R25 = CMP-2001-04908-2: RES Thick Film, 10kΩ, 1%, 0.125W, 100ppm/°C, 0805; Resistance: 10kR; Voltage Rating (DC): 150V; Power Rating: 125mW; Weight: 0.000194oz; Package Quantity: 5000; Military Standard: Not; Max Operating Temperature: 155°C; Temperature Coefficient: 100ppm/°C; Contact Plating: Tin; Width: 1.25mm; Height: 0.45mm; Radiation Hardening: No; Tolerance: 1%; Min Operating Temperature: -55°C; Voltage Rating: 150V; Length: 2mm; Depth: 1.25mm; Termination: SMD/SMT; Packaging: Tape and Reel; Case/Package: 0805; Case Code (Metric): 2012; Lead Free: Lead Free; Case Code (Imperial): 0805; Composition: Thick Film

## Sheet battery.SchDoc
size A; SheetNumber: 6; SheetTotal: 10
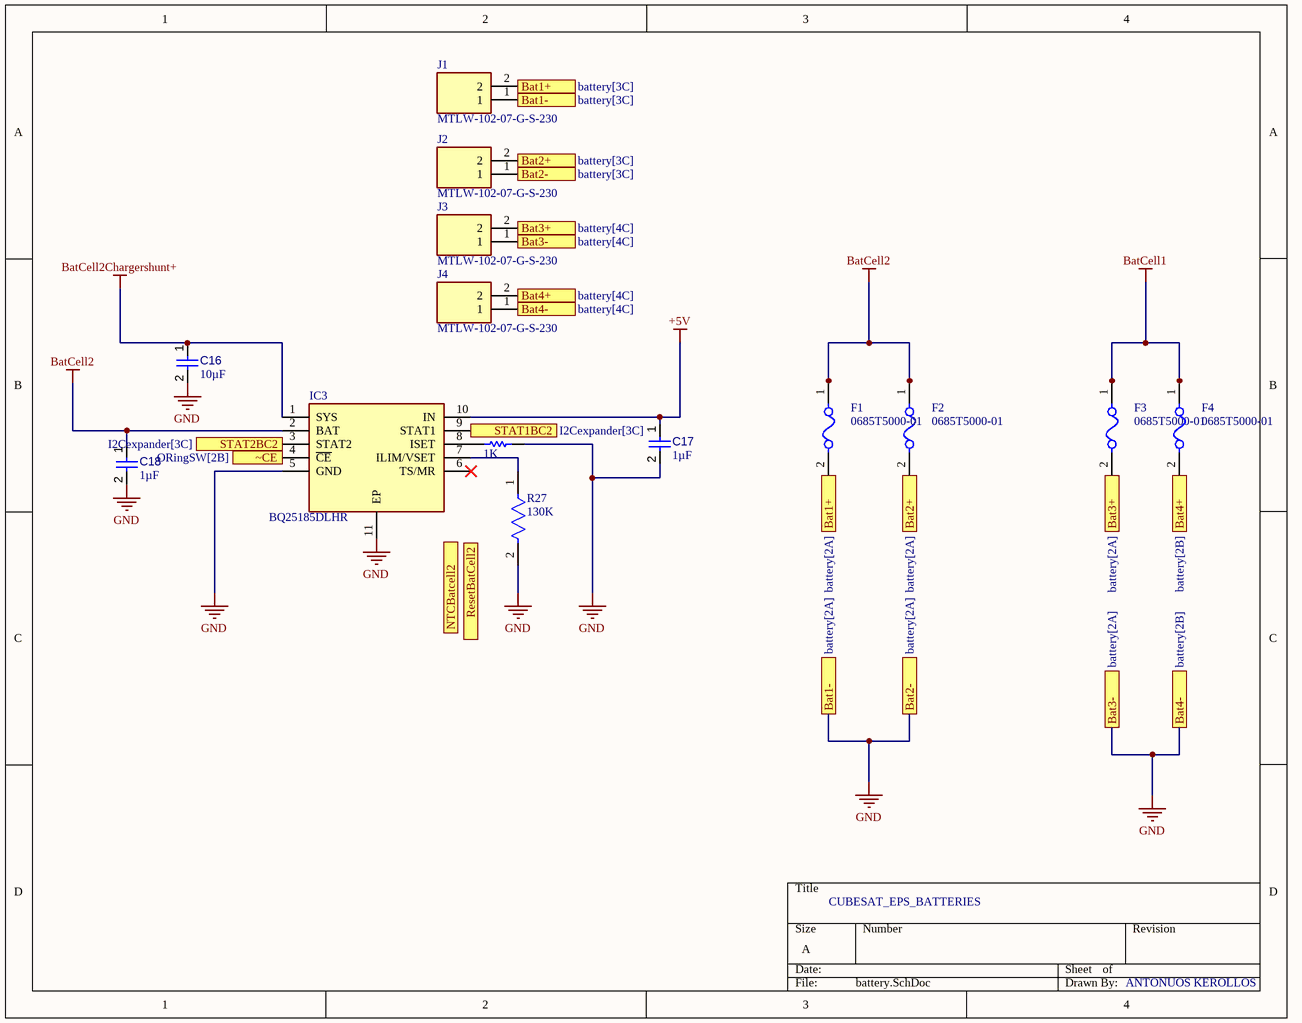
[diagram p5: battery.SchDoc]

### Parts
C16  value 10µF  [CAPC0402(1005)60_L]  (hidden comment: Capacitor 10µF +/-40% 6.3V 0402)
C17  value 1µF  [CAPC0402(1005)60_L]  (hidden comment: Capacitor 1µF +/-20% 10V 0402)
C18  value 1µF  [CAPC0402(1005)60_L]  (hidden comment: Capacitor 1µF +/-20% 10V 0402)
F1  0685T5000-01  [FP-0685T-MFG]
F2  0685T5000-01  [FP-0685T-MFG]
F3  0685T5000-01  [FP-0685T-MFG]
F4  0685T5000-01  [FP-0685T-MFG]
IC3  BQ25185DLHR  [SON40P220X200X80-11N]
J1  MTLW-102-07-G-S-230  [HDRV2W82P0X254_1X2_508X249X876P]
J2  MTLW-102-07-G-S-230  [HDRV2W82P0X254_1X2_508X249X876P]
J3  MTLW-102-07-G-S-230  [HDRV2W82P0X254_1X2_508X249X876P]
J4  MTLW-102-07-G-S-230  [HDRV2W82P0X254_1X2_508X249X876P]
R26  1K  [RESC2013X60X35ML10T20]
R27  130K  [FP-CRCW0805-e3-IPC_C]

### Ports
Bat1+ (see battery[2A]), Bat1+ (see battery[3C]), Bat1- (see battery[2A]), Bat1- (see battery[3C]), Bat2+ (see battery[2A]), Bat2+ (see battery[3C]), Bat2- (see battery[2A]), Bat2- (see battery[3C]), Bat3+ (see battery[2A]), Bat3+ (see battery[4C]), Bat3- (see battery[2A]), Bat3- (see battery[4C]), Bat4+ (see battery[2B]), Bat4+ (see battery[4C]), Bat4- (see battery[2B]), Bat4- (see battery[4C]), NTCBatcell2, ResetBatCell2, STAT1BC2 (see I2Cexpander[3C]), STAT2BC2 (see I2Cexpander[3C]), ~CE (see ORingSW[2B])

### Nets
+5V: C17.1 IC3.10(IN)
BatCell1: F3.1 F4.1
BatCell2: C18.1 F1.1 F2.1 IC3.2(BAT)
BatCell2Chargershunt+: C16.1 IC3.1(SYS)
GND: C16.2 C17.2 C18.2 IC3.5(GND) IC3.11(EP) J1.1 J2.1 J3.1 J4.1 R26.1 R27.2 ; port Bat1-, port Bat2-, port Bat3-, port Bat4-
NetF1_2: F1.2 J1.2 ; port Bat1+
NetF2_2: F2.2 J2.2 ; port Bat2+
NetF3_2: F3.2 J3.2 ; port Bat3+
NetF4_2: F4.2 J4.2 ; port Bat4+
NetIC2_4: IC3.9(STAT1) ; port STAT1BC2
NetIC2_5: IC3.3(STAT2) ; port STAT2BC2
NetIC3_7: IC3.7(ILIM/VSET) R27.1
NetIC3_8: IC3.8(ISET) R26.2
NetIC_1: IC3.4(~{CE}) ; port ~CE

Not connected (* = marked no-connect by the designer): IC3 6(TS/MR)*

### Notes on the sheet
- CUBESAT_EPS_BATTERIES
- ANTONUOS KEROLLOS

### Library data of the parts
C16 = CMP-001-00074-3: as C2 on sheet MPPTcharger; Case/Package: 0402; Pins: 2; Mounting Technology: SMT; Voltage Rating: 6.3V; Max Operating Temperature: 85°C; Min Operating Temperature: -55°C
C17 C18 = CMP-001-00063-3: as C1 on sheet MPPTcharger; Mounting Technology: SMT; Max Operating Temperature: 85°C; Voltage Rating: 10V; Pins: 2; Case/Package: 0402; Min Operating Temperature: -55°C
F1-F4 = CMP-16042-000006-1: FUSE BOARD MNT 5A 63VAC/VDC 1206; RoHS Compliant: Yes
IC3 = BQ25185DLHR: Integrated Circuit; Manufacturer_Name: Texas Instruments; Datasheet Link: https://www.ti.com/lit/ds/symlink/bq25185.pdf?ts=1706857561339&ref_url=https%253A%252F%252Fwww.ti.com%252Fproduct%252FBQ25185; Height: 0.8mm; Manufacturer_Part_Number: BQ25185DLHR; Mouser Part Number: 595-BQ25185DLHR; Mouser Price/Stock: https://www.mouser.co.uk/ProductDetail/Texas-Instruments/BQ25185DLHR?qs=Z%252BL2brAPG1IbO%2FV3RqsaPw%3D%3D
J1-J4 = MTLW-102-07-G-S-230: Connector; Manufacturer_Name: SAMTEC; Datasheet Link: https://componentsearchengine.com/Datasheets/1/MTLW-102-07-G-S-230.pdf; Height: 8.76mm; Manufacturer_Part_Number: MTLW-102-07-G-S-230; Mouser Part Number: 200-MTLW10207GS230; Mouser Price/Stock: https://www.mouser.com/Search/Refine.aspx?Keyword=200-MTLW10207GS230; Arrow Part Number: MTLW-102-07-G-S-230; Arrow Price/Stock: https://www.arrow.com/en/products/mtlw-102-07-g-s-230/samtec
R26 = CMP-2100-03671-1: Chip Resistor, 1 KOhm, +/- 1%, 125 mW, -55 to 155 degC, 0805 (2012 Metric), RoHS, Tape and Reel; Manufacturer: Yageo; Temperature Coefficient: 100ppm/degreesC; Voltage Rating (DC): 150V; Max Power Dissipation: 125mW; Resistance: 1KOhm; Number of Pins: 2; Number of Terminations: 2; Datasheet URL: http://www.yageo.com/NewPortal/yageodocoutput?fileName=/pdf/R-Chip/PYu-RC_Group_51_RoHS_L_5.pdf; Length: 0.079inch; Package Description: 2-Pin Surface Mounted Device, Body 2 x 1.25 mm; Depth: 1.25mm; Height: 0.024inch; Military Standard: Not; Case/Package: 0805; Package Reference: 0805; RoHSCompliant: true; Lead Free: LeadFree; Packaging: TapeandReel; Package Quantity: 1; Datasheet Version: Rev. 5, 10/2016; Tolerance: 1%; Min Operating Temperature: -55degC; Voltage Rating: 150V; Composition: ThickFilm; Case Code (Imperial): 0805; Power Rating: 125mW; Width: 0.049inch; Case Code (Metric): 2012; Manufacturer URL: http://www.yageo.com/; Max Operating Temperature: 155degC; REACH SVHC: Unknown; Termination: SMD/SMT
R27 = CMP-2001-04940-2: RES Thick Film, 130kΩ, 1%, 0.125W, 100ppm/°C, 0805; Working Voltage: 150V; Resistance: 130kR; Max Power Dissipation: 125mW; Case/Package: 0805; Packaging: Tape and Reel; Max Operating Temperature: 155°C; Military Standard: Not; Min Operating Temperature: -55°C; Composition: Thick Film; Package Quantity: 10; Width: 1.25mm; Number of Pins: 2; Mount: Surface Mount; Lead Free: Lead Free; Termination: SMD/SMT; Weight: 0.000194oz; Features: Automotive AEC-Q200; Radiation Hardening: No; Case Code (Imperial): 0805; Depth: 1.25mm; Voltage Rating (DC): 150V; Length: 2mm; Number of Terminations: 2; Power Rating: 125mW; Case Code (Metric): 2012; Voltage Rating: 150V; Contact Plating: Tin; Temperature Coefficient: 100ppm/°C; Tolerance: 1%; Height: 0.45mm

## Sheet CMandLS.SchDoc
size A; SheetNumber: 7; SheetTotal: 10
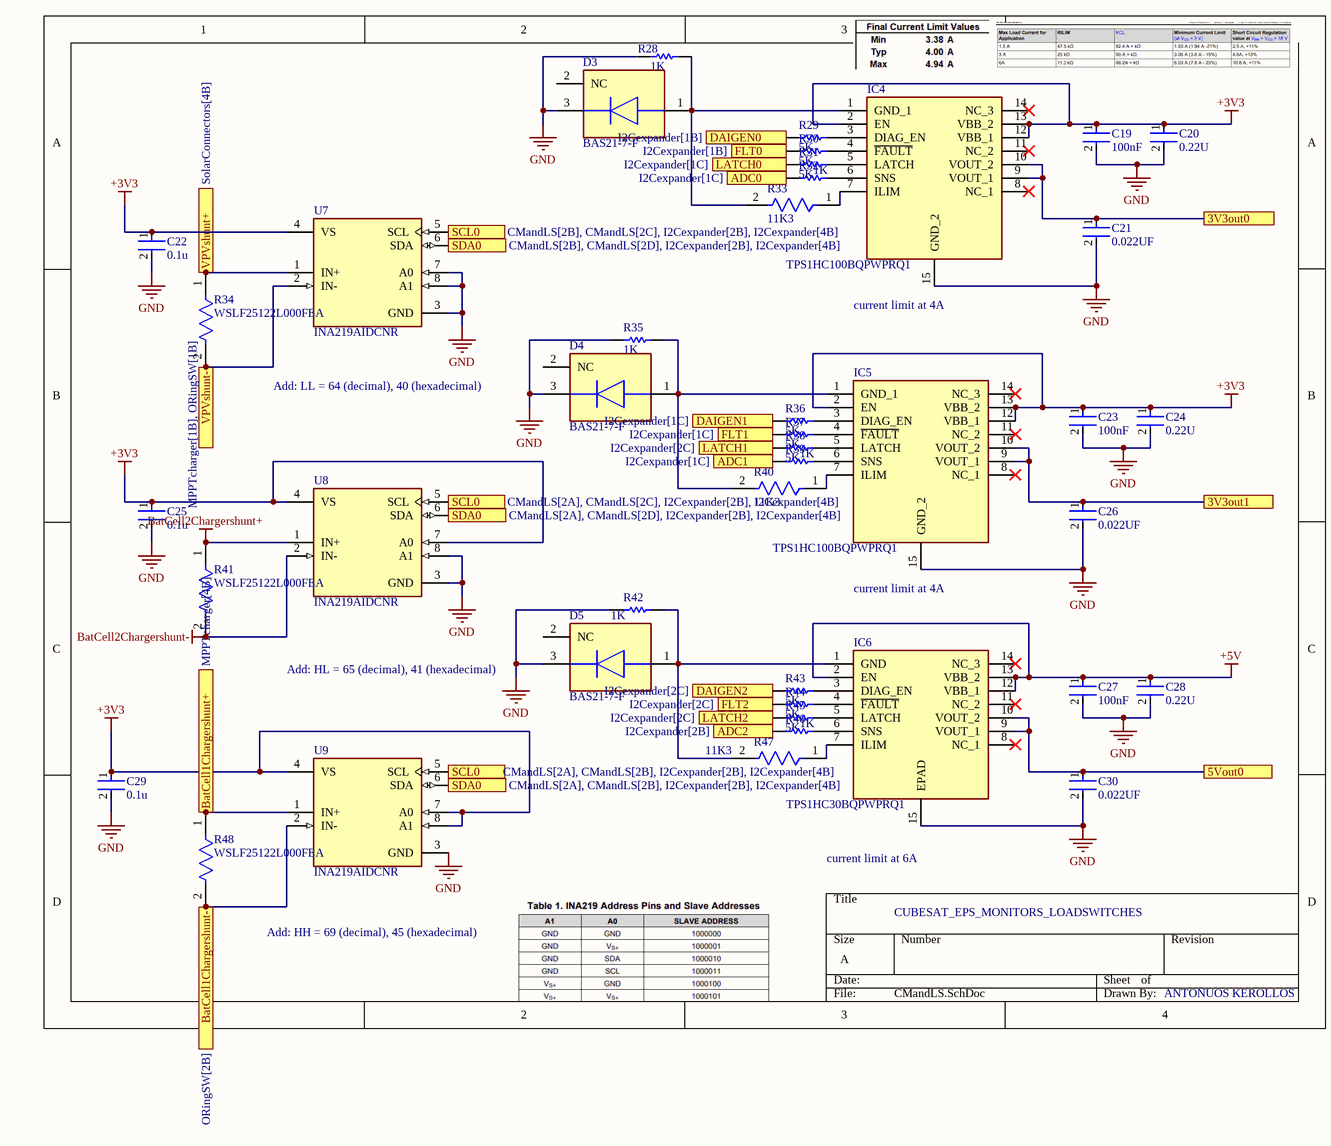
[diagram p6: CMandLS.SchDoc]

### Parts
C19  100nF  [FP-0805-L_2_01_0_2-W_1_25-IPC_B]
C20  0.22U  [FP-C0805C-DN-MFG]
C21  0.022UF  [FP-C0805C-DN-MFG]
C22  0.1u  [FP-C0402-BB-MFG]
C23  100nF  [FP-0805-L_2_01_0_2-W_1_25-IPC_B]
C24  0.22U  [FP-C0805C-DN-MFG]
C25  0.1u  [FP-C0402-BB-MFG]
C26  0.022UF  [FP-C0805C-DN-MFG]
C27  100nF  [FP-0805-L_2_01_0_2-W_1_25-IPC_B]
C28  0.22U  [FP-C0805C-DN-MFG]
C29  0.1u  [FP-C0402-BB-MFG]
C30  0.022UF  [FP-C0805C-DN-MFG]
D3  BAS21-7-F  [FP-SOT23-MFG]
D4  BAS21-7-F  [FP-SOT23-MFG]
D5  BAS21-7-F  [FP-SOT23-MFG]
IC4  TPS1HC100BQPWPRQ1  [SOP65P640X120-15N]
IC5  TPS1HC100BQPWPRQ1  [SOP65P640X120-15N]
IC6  TPS1HC30BQPWPRQ1  [SOP65P640X120-15N]
R28  1K  [RESC2013X60X35ML10T20]
R29  5K  [RESC2013X50X30ML20T20]
R30  5K  [RESC2013X50X30ML20T20]
R31  5K  [RESC2013X50X30ML20T20]
R32  1K  [RESC2013X60X35ML10T20]
R33  11K3  [FP-CRCW0805-e3-IPC_A]
R34  WSLF25122L000FEA  [FP-WSLF25122L000FEA-MFG]
R35  1K  [RESC2013X60X35ML10T20]
R36  5K  [RESC2013X50X30ML20T20]
R37  5K  [RESC2013X50X30ML20T20]
R38  5K  [RESC2013X50X30ML20T20]
R39  1K  [RESC2013X60X35ML10T20]
R40  11K3  [FP-CRCW0805-e3-IPC_A]
R41  WSLF25122L000FEA  [FP-WSLF25122L000FEA-MFG]
R42  1K  [RESC2013X60X35ML10T20]
R43  5K  [RESC2013X50X30ML20T20]
R44  5K  [RESC2013X50X30ML20T20]
R45  5K  [RESC2013X50X30ML20T20]
R46  1K  [RESC2013X60X35ML10T20]
R47  11K3  [FP-CRCW0805-e3-IPC_A]
R48  WSLF25122L000FEA  [FP-WSLF25122L000FEA-MFG]
U7  INA219AIDCNR  [FP-DCN0008A-IPC_B]
U8  INA219AIDCNR  [FP-DCN0008A-IPC_B]
U9  INA219AIDCNR  [FP-DCN0008A-IPC_B]

### Ports
3V3out0, 3V3out1, 5Vout0, ADC0 (see I2Cexpander[1C]), ADC1 (see I2Cexpander[1C]), ADC2 (see I2Cexpander[2B]), BatCell1Chargershunt+ (see MPPTcharger[4B]), BatCell1Chargershunt- (see ORingSW[2B]), DAIGEN0 (see I2Cexpander[1B]), DAIGEN1 (see I2Cexpander[1C]), DAIGEN2 (see I2Cexpander[2C]), FLT0 (see I2Cexpander[1B]), FLT1 (see I2Cexpander[1C]), FLT2 (see I2Cexpander[2C]), LATCH0 (see I2Cexpander[1C]), LATCH1 (see I2Cexpander[2C]), LATCH2 (see I2Cexpander[2C]), SCL0 (see CMandLS[2A], CMandLS[2B], I2Cexpander[2B], I2Cexpander[4B]), SCL0 (see CMandLS[2A], CMandLS[2C], I2Cexpander[2B], I2Cexpander[4B]), SCL0 (see CMandLS[2B], CMandLS[2C], I2Cexpander[2B], I2Cexpander[4B]), SDA0 (see CMandLS[2A], CMandLS[2B], I2Cexpander[2B], I2Cexpander[4B]), SDA0 (see CMandLS[2A], CMandLS[2D], I2Cexpander[2B], I2Cexpander[4B]), SDA0 (see CMandLS[2B], CMandLS[2D], I2Cexpander[2B], I2Cexpander[4B]), VPVshunt+ (see SolarConnectors[4B]), VPVshunt- (see MPPTcharger[1B], ORingSW[1B])

### Nets
+3V3: C19.1 C20.1 C22.1 C23.1 C24.1 C25.1 C29.1 IC4.2(EN) IC4.12(VBB_1) IC4.13(VBB_2) IC5.2(EN) IC5.12(VBB_1) IC5.13(VBB_2) U7.4(VS) U8.4(VS) U8.7(A0) U9.4(VS) U9.7(A0) U9.8(A1)
+5V: C27.1 C28.1 IC6.2(EN) IC6.12(VBB_1) IC6.13(VBB_2)
BatCell2Chargershunt+: R41.1 U8.1(IN+)
BatCell2Chargershunt-: R41.2 U8.2(IN-)
GND: C19.2 C20.2 C21.2 C22.2 C23.2 C24.2 C25.2 C26.2 C27.2 C28.2 C29.2 C30.2 D3.3(C) D4.3(C) D5.3(C) IC4.15(GND_2) IC5.15(GND_2) IC6.15(EPAD) R28.2 R35.2 R42.2 U7.3(GND) U7.7(A0) U7.8(A1) U8.3(GND) U8.8(A1) U9.3(GND)
PV power: R34.2 U7.2(IN-) ; port VPVshunt-
NetC3_1: R48.1 U9.1(IN+) ; port BatCell1Chargershunt+
NetC21_1: C21.1 IC4.9(VOUT_1) IC4.10(VOUT_2) ; port 3V3out0
NetC26_1: C26.1 IC5.9(VOUT_1) IC5.10(VOUT_2) ; port 3V3out1
NetC30_1: C30.1 IC6.9(VOUT_1) IC6.10(VOUT_2) ; port 5Vout0
NetD3_1: D3.1(A) IC4.1(GND_1) R28.1 R33.2
NetD4_1: D4.1(A) IC5.1(GND_1) R35.1 R40.2
NetD5_1: D5.1(A) IC6.1(GND) R42.1 R47.2
NetIC1_1: R29.1 ; port DAIGEN0
NetIC1_2: R30.1 ; port FLT0
NetIC1_3: R31.1 ; port LATCH0
NetIC1_4: R32.1 ; port ADC0
NetIC1_5: R36.1 ; port DAIGEN1
NetIC1_6: R37.1 ; port FLT1
NetIC1_7: R39.1 ; port ADC1
NetIC1_8: R38.1 ; port LATCH1
NetIC1_14: R43.1 ; port DAIGEN2
NetIC1_15: R44.1 ; port FLT2
NetIC1_16: R45.1 ; port LATCH2
NetIC1_17: R46.1 ; port ADC2
NetIC1_19: U7.5(SCL) U8.5(SCL) U9.5(SCL) ; port SCL0
NetIC1_20: U7.6(SDA) U8.6(SDA) U9.6(SDA) ; port SDA0
NetIC4_3: IC4.3(DIAG_EN) R29.2
NetIC4_4: IC4.4(~{FAULT}) R30.2
NetIC4_5: IC4.5(LATCH) R31.2
NetIC4_6: IC4.6(SNS) R32.2
NetIC4_7: IC4.7(ILIM) R33.1
NetIC5_3: IC5.3(DIAG_EN) R36.2
NetIC5_4: IC5.4(~{FAULT}) R37.2
NetIC5_5: IC5.5(LATCH) R38.2
NetIC5_6: IC5.6(SNS) R39.2
NetIC5_7: IC5.7(ILIM) R40.1
NetIC6_3: IC6.3(DIAG_EN) R43.2
NetIC6_4: IC6.4(~{FAULT}) R44.2
NetIC6_5: IC6.5(LATCH) R45.2
NetIC6_6: IC6.6(SNS) R46.2
NetIC6_7: IC6.7(ILIM) R47.1
NetQ4_1: R34.1 U7.1(IN+) ; port VPVshunt+
NetR48_2: R48.2 U9.2(IN-) ; port BatCell1Chargershunt-

Not connected (* = marked no-connect by the designer): D3 2(NC); D4 2(NC); D5 2(NC); IC4 8(NC_1)* 11(NC_2)* 14(NC_3)*; IC5 8(NC_1)* 11(NC_2)* 14(NC_3)*; IC6 8(NC_1)* 11(NC_2)* 14(NC_3)*

### Notes on the sheet
- (near IC4) current limit at 4A
- Add: LL = 64 (decimal), 40 (hexadecimal)
- (near IC5) current limit at 4A
- (near D5) Add: HL = 65 (decimal), 41 (hexadecimal)
- current limit at 6A
- CUBESAT_EPS_MONITORS_LOADSWITCHES
- Add: HH = 69 (decimal), 45 (hexadecimal)
- ANTONUOS KEROLLOS

### Library data of the parts
C19 C23 C27 = CMP-2007-04172-2: Automotive Ceramic Capacitor, 0805, 100nF, 10%, X7R, 15%, 100V; Voltage Rating (DC): 100V; Case Code (Metric): 2012; Mount: Surface Mount; Length: 2.01mm; Depth: 1.25mm; Lead Free: Lead Free; Ratings: AEC-Q200; Max Operating Temperature: 125°C; Tolerance: 10%; Case/Package: 0805; Width: 0.049inch; Package Quantity: 1; Thickness: 0.055inch; Construction: Flat; Min Operating Temperature: -55°C; REACH SVHC: No SVHC; Number of Pins: 2; Radiation Hardening: No; Capacitance: 100nF; Voltage Rating: 100V; Height: 1.4mm; Series: -; Voltage: 100V; Dielectric: X7R; Termination: SMD/SMT; Case Code (Imperial): 0805; RoHS Compliant: Yes; Packaging: Tape and Reel; Dielectric Material: Ceramic
C20 C24 C28 = CMP-2007-03262-2: CAP CER 0.22UF 100V 10% X7R 0805; Manufacturer Part Number: C0805C224K1RACTU; Manufacturer: KEMET; Material: Ceramic; Tolerance: 0.1; Value: 0.22 μF; Temperature Coefficient: 30ppm/°C; Temperature Range High: +125°C; Temperature Range Low: -55°C; Voltage Rating: 100 V; Device Class L2: Capacitors; Octopart: https://octopart.com/c0805c224k1ractu-kemet-12818106; ComponentLink2URL: https://content.kemet.com/datasheets/KEM_C1003_C0G_SMD.pdf; RoHS: TRUE; Temperature: -55°C to +125°C; Ipc Land Pattern Name: CAPC200125X78; Category: Cap; ComponentLink2Description: Datasheet; Height: 0.88mm; Device Class L1: Passive Components; Digikey Description: CAP CER 0.22UF 100V 10% X7R 0805; Mouser Description: 0805 C 220nF Ceramic Multilayer Capacitor, 100 V, +125degC, X7R Dielec, +/-10%; Capacitance: 0.22 μF; Package: C0805C-DN; Lead Free: Yes; Automotive: No; Temperature Characteristic: X7R; Device Class L3: Ceramic Capacitors
C21 C26 C30 = CMP-2007-00338-2: CAP CER 0.022UF 50V X7R 0805; Manufacturer: KEMET; Manufacturer Part Number: C0805C223K5RACTU; Value: 22,000 pF; Material: Ceramic; Tolerance: 0.1; Temperature Coefficient: 30ppm/°C; Automotive: No; Package: C0805C-DN; RoHS: TRUE; Height: 0.88mm; Lead Free: Yes; Temperature Range Low: -55°C; Digikey Description: CAP CER 0.022UF 50V X7R 0805; ComponentLink2Description: Datasheet; Capacitance: 22,000 pF; Mouser Description: Capacitor; Ceramic; Cap; .022uF; Tol 10%; SMT; Vol-Rtg 50V; X7R; Tape and Reel; Device Class L3: Ceramic Capacitors; Category: Cap; Voltage Rating: 50 V; Temperature Characteristic: X7R; Ipc Land Pattern Name: CAPC200125X78; Octopart: https://octopart.com/c0805c223k5ractu-kemet-145968; Device Class L1: Passive Components; Temperature: -55°C to +125°C; ComponentLink2URL: https://content.kemet.com/datasheets/KEM_C1003_C0G_SMD.pdf; Temperature Range High: +125°C; Device Class L2: Capacitors
C22 C25 C29 = CMP-2008-02046-2: CAP CER 0.1UF 10V X5R 0402; Manufacturer: Kemet; Manufacturer Part Number: C0402C104K8PACTU; Material: Ceramic; Capacitance: 0.10 μF; Temperature Coefficient: 15%; Tolerance: 0.1; Value: 0.10 μF; Package: C0402-BB; Temperature: -55°C to +125°C; ComponentLink2Description: Datasheet; Temperature Characteristic: X5R; Device Class L1: Passive Components; Height: 0.55mm; Lead Free: Yes; ComponentLink2URL: https://content.kemet.com/datasheets/KEM_C1002_X7R_SMD.pdf; Device Class L2: Capacitors; Temperature Range Low: -55°C; Temperature Range High: +125°C; RoHS: TRUE; Octopart: https://octopart.com/c0402c104k8pactu-kemet-140039; Automotive: No; Mouser Description: Capacitor 100 nF 10 VDC 0402; Category: Cap; Voltage Rating: 10 V; Digikey Description: CAP CER 0.1UF 10V X5R 0402; Ipc Land Pattern Name: CAPC10050X50; Device Class L3: Ceramic Capacitors
D3-D5 = CMP-12791-000036-1: DIODE GEN PURP 200V 200MA SOT23; Manufacturer: Diodes Inc.; Max Repetitive Reverse Voltage: 250V; Forward Current: 400mA; Max Surge Forward Current: 0.5A; Standoff Height: 0.013mm; Capacitance: 5pF; Max Junction Temp: +150°C; Peak Reverse Current: 0.1uA; Value: 5pF; Device Class L1: Discrete Semiconductors; Category: Diode; Mouser Description: Diodes - General Purpose, Power, Switching 200V 350mW; Digikey Description: DIODE GEN PURP 200V 200MA SOT23; Manufacturer Part Number: BAS21-7-F; Device Class L2: Diodes; RoHS: TRUE; Device Class L3: Rectifier Diodes; Lead Free: Yes; Temperature Range High: +150°C; Ipc Land Pattern Name: SOT92P240X102-3; ComponentLink2Description: Datasheet; Octopart: https://octopart.com/bas21-7-f-diodes+inc.-325943; Reverse Voltage: 200V; Height: 1.1mm; Automotive: No; ComponentLink2URL: https://www.diodes.com/assets/Datasheets/Ds12004.pdf; Temperature: -65°C to +150°C; Temperature Range Low: -65°C; Footprint Url: https://www.diodes.com/assets/Package-Files/SOT23.pdf; Package: SOT23
IC4 IC5 = TPS1HC100BQPWPRQ1: Integrated Circuit; Manufacturer_Name: Texas Instruments; Datasheet Link: https://www.ti.com/lit/ds/symlink/tps1hc100-q1.pdf?ts=1676455142846&ref_url=https%253A%252F%252Fwww.ti.com%252Fproduct%252FTPS1HC100-Q1%252Fpart-details%252FTPS1HC100BQPWPRQ1; Height: 1.2mm; Manufacturer_Part_Number: TPS1HC100BQPWPRQ1; Mouser Part Number: 595-PS1HC100BQPWPRQ1; Mouser Price/Stock: https://www.mouser.co.uk/ProductDetail/Texas-Instruments/TPS1HC100BQPWPRQ1?qs=doiCPypUmgGr2qWxBCPLzg%3D%3D
IC6 = TPS1HC30BQPWPRQ1: Integrated Circuit; Manufacturer_Name: Texas Instruments; Datasheet Link: https://www.ti.com/lit/ds/symlink/tps1hc30-q1.pdf?ts=1709608283144&ref_url=https%253A%252F%252Fwww.ti.com%252Fproduct%252FTPS1HC30-Q1%252Fpart-details%252FTPS1HC30BQPWPRQ1; Height: 1.2mm; Manufacturer_Part_Number: TPS1HC30BQPWPRQ1; Mouser Part Number: 595-TPS1HC30BQPWPRQ1; Mouser Price/Stock: https://www.mouser.co.uk/ProductDetail/Texas-Instruments/TPS1HC30BQPWPRQ1?qs=rQFj71Wb1eWIl26jD%2FvpUw%3D%3D
R28 R32 R35 R39 R42 R46 = CMP-2100-03671-1: as R26 on sheet battery; Number of Pins: 2; Number of Terminations: 2; Datasheet URL: http://www.yageo.com/NewPortal/yageodocoutput?fileName=/pdf/R-Chip/PYu-RC_Group_51_RoHS_L_5.pdf; Length: 0.079inch; Package Description: 2-Pin Surface Mounted Device, Body 2 x 1.25 mm; Depth: 1.25mm; Height: 0.024inch; Military Standard: Not; Case/Package: 0805; Package Reference: 0805; RoHSCompliant: true; Lead Free: LeadFree; Packaging: TapeandReel; Package Quantity: 1; Datasheet Version: Rev. 5, 10/2016; Tolerance: 1%; Min Operating Temperature: -55degC; Voltage Rating: 150V; Composition: ThickFilm; Case Code (Imperial): 0805; Power Rating: 125mW; Width: 0.049inch; Case Code (Metric): 2012; Manufacturer URL: http://www.yageo.com/; Max Operating Temperature: 155degC; REACH SVHC: Unknown; Termination: SMD/SMT
R29-R31 R36-R38 R43-R45 = CMP-2001-04239-1: Part Number: CRCW08055K00FKTA; Manufacturer: Vishay Dale
R33 R40 R47 = CMP-02407-005171-1: RES Thick Film, 11.3kΩ, 1%, 0.125W, 100ppm/°C, 0805; Max Power Dissipation: 125mW; Voltage Rating: 150V; Resistance: 11.3kR; Termination: SMD/SMT; Case/Package: 0805; Composition: Thick Film; Height: 0.45mm; Temperature Coefficient: 100ppm/°C; Features: Automotive AEC-Q200; Min Operating Temperature: -55°C; Width: 0.049inch; Case Code (Metric): 2012; Voltage Rating (DC): 150V; Packaging: Tape and Reel; Case Code (Imperial): 0805; Length: 2mm; Tolerance: 1%; Number of Terminations: 2; Contact Plating: Tin; Weight: 0.000194oz; Depth: 1.25mm; Max Operating Temperature: 155°C; Power Rating: 125mW; Military Standard: Not; Package Quantity: 10; Radiation Hardening: No; Lead Free: Lead Free
R34 R41 R48 = CMP-02407-012168-1: RES 0.002 OHM 1% 5W 2512; Resistance: 2mR; Temperature Coefficient: 70ppm/°C; RoHS Compliant: Yes; Case/Package: 2512; Length: 0.25inch; Height: 0.024inch; Max Power Dissipation: 5W; Lead Free: Lead Free; Features: Moisture Resistant; Min Operating Temperature: -65°C; Max Operating Temperature: 170°C; Case Code (Metric): 6432; Tolerance: 1%; Width: 0.125inch; Case Code (Imperial): 2512; Packaging: Tape and Reel; Resistor Type: Metal Element; Number of Terminations: 2
U7-U9 = CMP-0704-00041-3: IC CURRENT MONITOR 1% SOT23-8; Common Mode Rejection Ratio: 100dB; Bandwidth: 3.4MHz; Operating Supply Current: 1mA; Nominal Supply Current: 700uA; Min Input Voltage: 0V; Output Current per Channel: 10mA; Number of Amplifiers: 1; Input Offset Voltage (Vos): 100uV; Max Input Voltage: 26V; Min Supply Voltage: 3V; Max Supply Current: 5mA; Max Supply Voltage: 5.5V; Output Type: Digital; Accuracy: 1%; Radiation Hardening: No; Min Operating Temperature: -40°C; Contact Plating: Gold; REACH SVHC: No SVHC; Packaging: Tape and Reel; Max Operating Temperature: 125°C; Lead Free: Lead Free; Weight: 0.001411oz; Supply Current: 700uA; Number of Pins: 8; Length: 3mm; Quiescent Current: 700uA; Features: I²C; Height: 1.3mm; Output Current: 10mA; Case/Package: SOT-23-8; RoHS Compliant: Yes; Width: 1.75mm; Package Quantity: 3000; Series: Zero-Drift